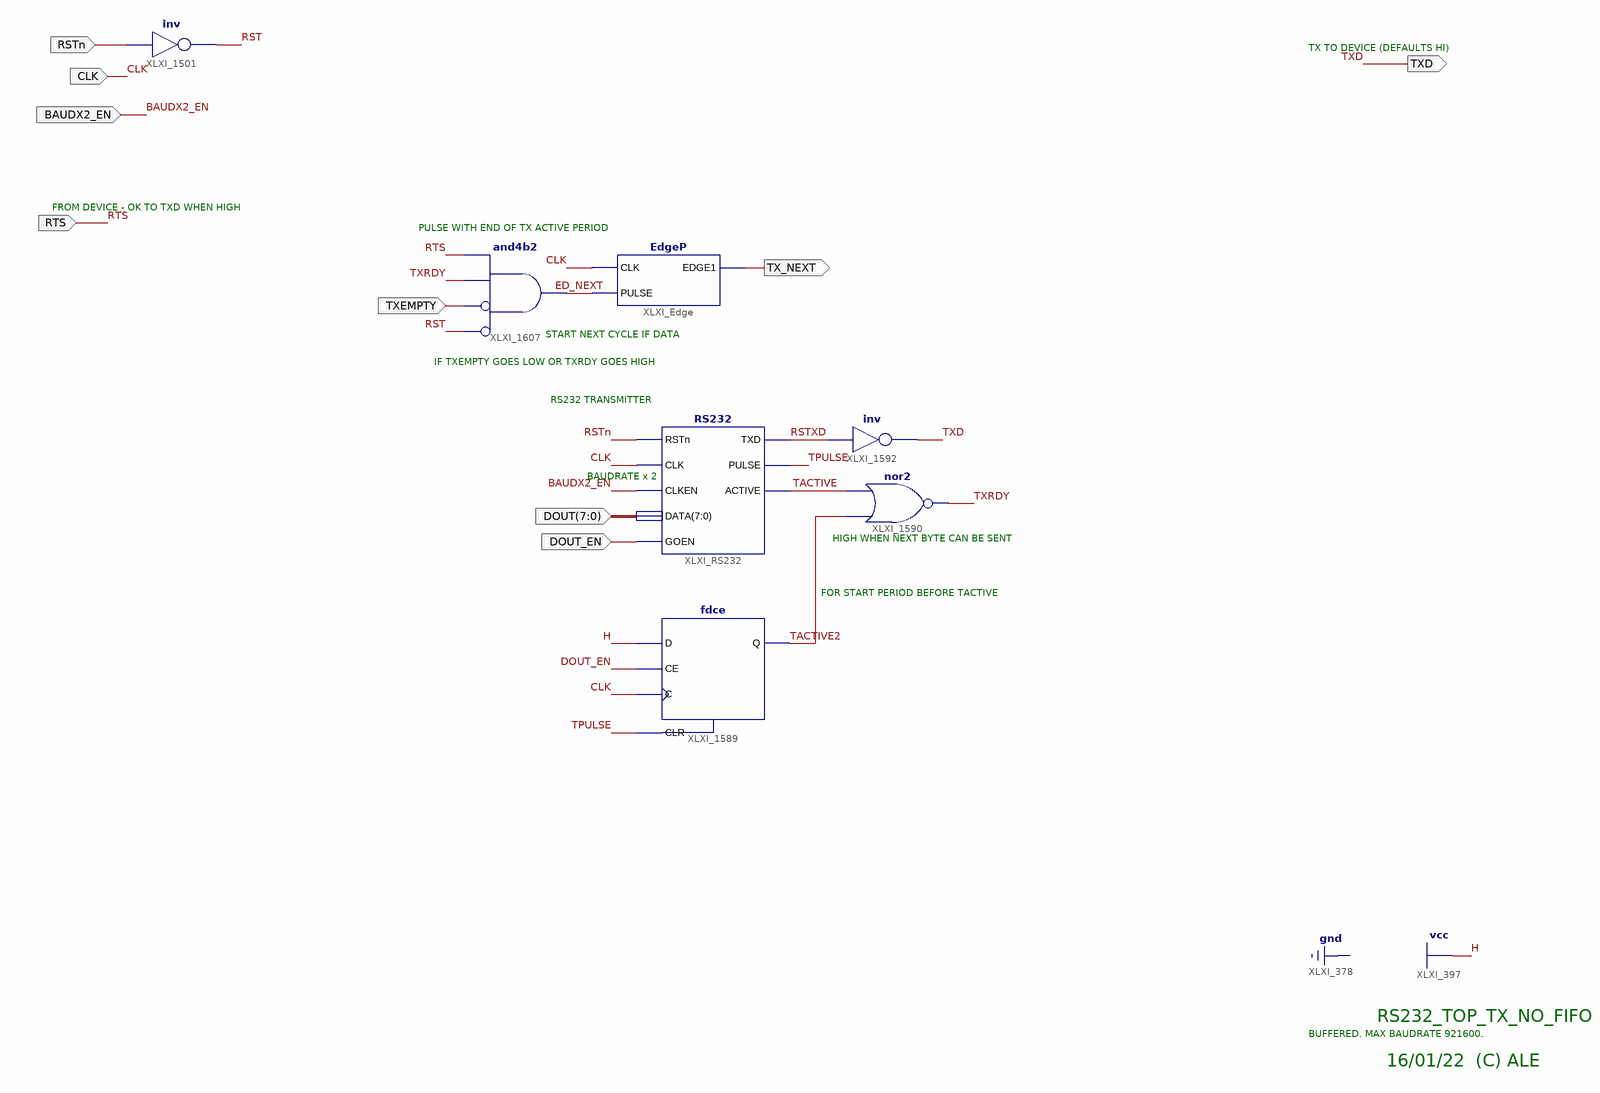
[diagram p0: schematic sheet 1]
// Xilinx ISE schematic RS232_TOP_TX_NO_FIFO.sch (spartan3e) as structural Verilog: 7 symbols, 9 ports
module RS232_TOP_TX_NO_FIFO (
  input  CLK,
  input  RSTn,
  input  TXEMPTY,
  input  RTS,
  input  BAUDX2_EN,
  input  DOUT_EN,
  input  [7:0] DOUT,
  output TXD,
  output TX_NEXT
);

  wire ED_NEXT, RST, RSTXD, TACTIVE, TACTIVE2, TPULSE, TXRDY;

  not XLXI_1501 (RST, RSTn);
  EdgeP XLXI_Edge (.CLK(CLK), .EDGE1(TX_NEXT), .PULSE(ED_NEXT));
  and XLXI_1607 (ED_NEXT, ~RST, ~TXEMPTY, TXRDY, RTS);  // and4b2
  nor XLXI_1590 (TXRDY, TACTIVE2, TACTIVE);
  not XLXI_1592 (TXD, RSTXD);
  fdce XLXI_1589 (.C(CLK), .CE(DOUT_EN), .CLR(TPULSE), .D(1'b1), .Q(TACTIVE2));
  RS232 XLXI_RS232 (
    .ACTIVE(TACTIVE), .CLK(CLK), .CLKEN(BAUDX2_EN), .DATA(DOUT), .GOEN(DOUT_EN), .PULSE(TPULSE), .RSTn(RSTn),
    .TXD(RSTXD));

  // Notes on the sheet:
  //   TX TO DEVICE (DEFAULTS HI)
  //   FROM DEVICE - OK TO TXD WHEN HIGH
  //   PULSE WITH END OF TX ACTIVE PERIOD
  //   START NEXT CYCLE IF DATA
  //   IF TXEMPTY GOES LOW OR TXRDY GOES HIGH
  //   RS232 TRANSMITTER
  //   BAUDRATE x 2
  //   HIGH WHEN NEXT BYTE CAN BE SENT
  //   FOR START PERIOD BEFORE TACTIVE
  //   RS232_TOP_TX_NO_FIFO
  //   BUFFERED. MAX BAUDRATE 921600.
  //   16/01/22  (C) ALE
endmodule
